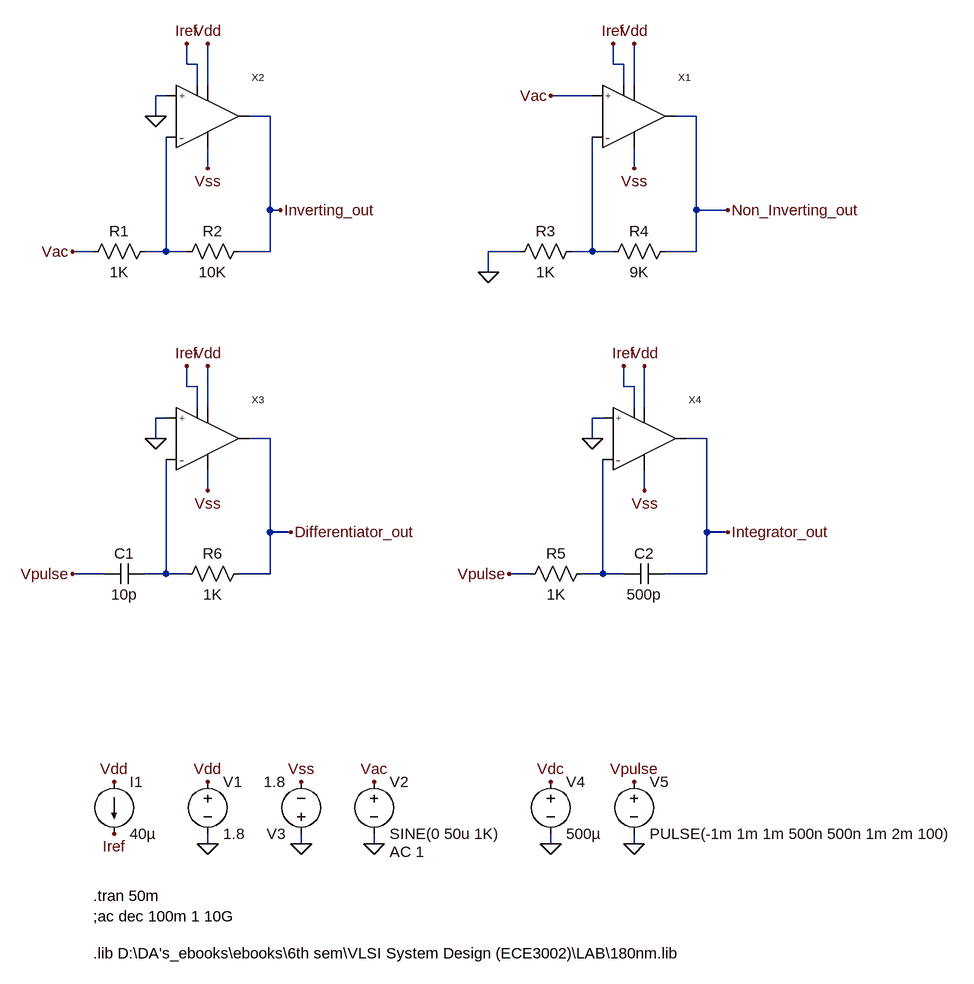
[diagram p0: schematic Two_Stage_CMOS_Op_Amp_tb.asc]
Two_Stage_CMOS_Op_Amp_tb.asc, the LTspice schematic file:
Version 4
SHEET 1 1716 792
WIRE -112 -592 -112 -624
WIRE -96 -592 -112 -592
WIRE 544 -592 544 -624
WIRE 560 -592 544 -592
WIRE -96 -560 -96 -592
WIRE -80 -560 -80 -624
WIRE 560 -560 560 -592
WIRE 576 -560 576 -624
WIRE -144 -544 -160 -544
WIRE 512 -544 448 -544
WIRE -160 -512 -160 -544
WIRE 16 -512 -16 -512
WIRE 672 -512 640 -512
WIRE -80 -432 -80 -464
WIRE 576 -432 576 -464
WIRE 16 -368 16 -512
WIRE 32 -368 16 -368
WIRE 672 -368 672 -512
WIRE 720 -368 672 -368
WIRE -256 -304 -288 -304
WIRE -144 -304 -144 -480
WIRE -144 -304 -176 -304
WIRE -112 -304 -144 -304
WIRE 16 -304 16 -368
WIRE 16 -304 -32 -304
WIRE 400 -304 352 -304
WIRE 512 -304 512 -480
WIRE 512 -304 480 -304
WIRE 544 -304 512 -304
WIRE 672 -304 672 -368
WIRE 672 -304 624 -304
WIRE 352 -272 352 -304
WIRE -112 -96 -112 -128
WIRE -96 -96 -112 -96
WIRE 560 -96 560 -128
WIRE 576 -96 560 -96
WIRE -96 -64 -96 -96
WIRE -80 -64 -80 -128
WIRE 576 -64 576 -96
WIRE 592 -64 592 -128
WIRE -144 -48 -160 -48
WIRE 528 -48 512 -48
WIRE -160 -16 -160 -48
WIRE 16 -16 -16 -16
WIRE 512 -16 512 -48
WIRE 688 -16 656 -16
WIRE -80 64 -80 32
WIRE 592 64 592 32
WIRE 16 128 16 -16
WIRE 48 128 16 128
WIRE 688 128 688 -16
WIRE 720 128 688 128
WIRE -240 192 -288 192
WIRE -144 192 -144 16
WIRE -144 192 -176 192
WIRE -112 192 -144 192
WIRE 16 192 16 128
WIRE 16 192 -32 192
WIRE 416 192 384 192
WIRE 528 192 528 16
WIRE 528 192 496 192
WIRE 560 192 528 192
WIRE 688 192 688 128
WIRE 688 192 624 192
WIRE -80 608 -80 592
WIRE 64 608 64 592
WIRE 176 608 176 592
WIRE 448 608 448 592
WIRE 576 608 576 592
FLAG -80 608 0
FLAG -80 512 Vdd
FLAG -80 -624 Vdd
FLAG -224 592 Iref
FLAG -112 -624 Iref
FLAG -224 512 Vdd
FLAG 176 608 0
FLAG 176 512 Vac
FLAG 64 608 0
FLAG 64 512 Vss
FLAG -80 -432 Vss
FLAG -160 -512 0
FLAG 576 -624 Vdd
FLAG 544 -624 Iref
FLAG 576 -432 Vss
FLAG 352 -272 0
FLAG -288 -304 Vac
FLAG 448 -544 Vac
FLAG 448 608 0
FLAG 448 512 Vdc
FLAG -80 -128 Vdd
FLAG -112 -128 Iref
FLAG -80 64 Vss
FLAG -160 -16 0
FLAG -288 192 Vpulse
FLAG 576 608 0
FLAG 576 512 Vpulse
FLAG 592 -128 Vdd
FLAG 560 -128 Iref
FLAG 592 64 Vss
FLAG 512 -16 0
FLAG 384 192 Vpulse
FLAG 32 -368 Inverting_out
FLAG 720 -368 Non_Inverting_out
FLAG 48 128 Differentiator_out
FLAG 720 128 Integrator_out
SYMBOL voltage -80 496 R0
WINDOW 123 0 0 Left 0
WINDOW 39 0 0 Left 0
SYMATTR InstName V1
SYMATTR Value 1.8
SYMBOL current -224 512 R0
WINDOW 123 0 0 Left 0
WINDOW 39 0 0 Left 0
SYMATTR InstName I1
SYMATTR Value 40µ
SYMBOL voltage 176 496 R0
WINDOW 123 24 124 Left 2
WINDOW 39 0 0 Left 0
SYMATTR Value2 AC 1
SYMATTR InstName V2
SYMATTR Value SINE(0 50u 1K)
SYMBOL res -160 -320 R90
WINDOW 0 0 56 VBottom 2
WINDOW 3 32 56 VTop 2
SYMATTR InstName R1
SYMATTR Value 1K
SYMBOL res -16 -320 R90
WINDOW 0 0 56 VBottom 2
WINDOW 3 32 56 VTop 2
SYMATTR InstName R2
SYMATTR Value 10K
SYMBOL voltage 64 608 R180
WINDOW 123 0 0 Left 0
WINDOW 39 0 0 Left 0
SYMATTR InstName V3
SYMATTR Value 1.8
SYMBOL Two_Stage_CMOS_Op_Amp -96 -512 R0
SYMATTR InstName X2
SYMBOL res 496 -320 R90
WINDOW 0 0 56 VBottom 2
WINDOW 3 32 56 VTop 2
SYMATTR InstName R3
SYMATTR Value 1K
SYMBOL res 640 -320 R90
WINDOW 0 0 56 VBottom 2
WINDOW 3 32 56 VTop 2
SYMATTR InstName R4
SYMATTR Value 9K
SYMBOL Two_Stage_CMOS_Op_Amp 560 -512 R0
SYMATTR InstName X1
SYMBOL voltage 448 496 R0
WINDOW 123 0 0 Left 0
WINDOW 39 0 0 Left 0
SYMATTR InstName V4
SYMATTR Value 500µ
SYMBOL res -16 176 R90
WINDOW 0 0 56 VBottom 2
WINDOW 3 32 56 VTop 2
SYMATTR InstName R6
SYMATTR Value 1K
SYMBOL Two_Stage_CMOS_Op_Amp -96 -16 R0
SYMATTR InstName X3
SYMBOL cap -176 176 R90
WINDOW 0 0 32 VBottom 2
WINDOW 3 32 32 VTop 2
SYMATTR InstName C1
SYMATTR Value 10p
SYMBOL voltage 576 496 R0
WINDOW 123 0 0 Left 0
WINDOW 39 0 0 Left 0
SYMATTR InstName V5
SYMATTR Value PULSE(-1m 1m 1m 500n 500n 1m 2m 100)
SYMBOL res 512 176 R90
WINDOW 0 0 56 VBottom 2
WINDOW 3 32 56 VTop 2
SYMATTR InstName R5
SYMATTR Value 1K
SYMBOL Two_Stage_CMOS_Op_Amp 576 -16 R0
SYMATTR InstName X4
SYMBOL cap 624 176 R90
WINDOW 0 0 32 VBottom 2
WINDOW 3 32 32 VTop 2
SYMATTR InstName C2
SYMATTR Value 500p
TEXT -256 688 Left 2 !.tran 50m\n;ac dec 100m 1 10G
TEXT -256 776 Left 2 !.lib D:\\DA's_ebooks\\ebooks\\6th sem\\VLSI System Design (ECE3002)\\LAB\\180nm.lib

The netlist it stands for:
* Two_Stage_CMOS_Op_Amp_tb.asc
V1 Vdd 0 1.8
I1 Vdd Iref 40µ
V2 Vac 0 SINE(0 50u 1K) AC 1
R1 N001 Vac 1K
R2 Inverting_out N001 10K
V3 0 Vss 1.8
XX2 Vdd Vss 0 N001 Inverting_out Iref Two_Stage_CMOS_Op_Amp  ; pins Vdd Vss V+ V- Vout Iref
R3 N002 0 1K
R4 Non_Inverting_out N002 9K
XX1 Vdd Vss Vac N002 Non_Inverting_out Iref Two_Stage_CMOS_Op_Amp  ; pins Vdd Vss V+ V- Vout Iref
V4 Vdc 0 500µ
R6 Differentiator_out N003 1K
XX3 Vdd Vss 0 N003 Differentiator_out Iref Two_Stage_CMOS_Op_Amp  ; pins Vdd Vss V+ V- Vout Iref
C1 N003 Vpulse 10p
V5 Vpulse 0 PULSE(-1m 1m 1m 500n 500n 1m 2m 100)
R5 N004 Vpulse 1K
XX4 Vdd Vss 0 N004 Integrator_out Iref Two_Stage_CMOS_Op_Amp  ; pins Vdd Vss V+ V- Vout Iref
C2 Integrator_out N004 500p
.tran 50m
;ac dec 100m 1 10G
.lib D:\DA's_ebooks\ebooks\6th sem\VLSI System Design (ECE3002)\LAB\180nm.lib
.backanno
.end